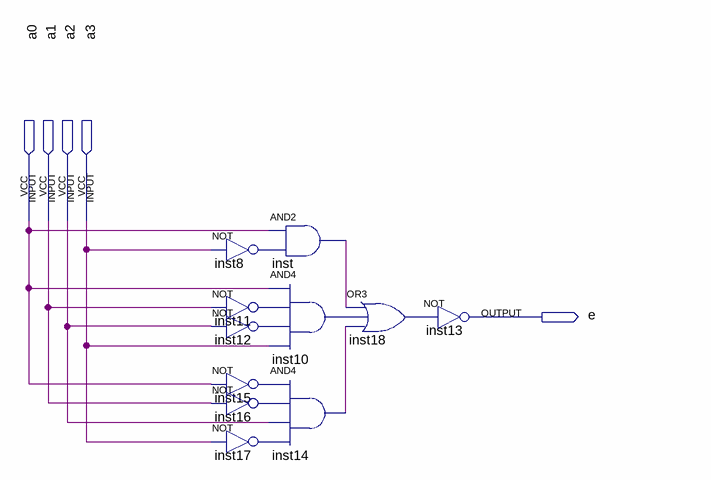
[diagram p0: schematic sheet]
// Quartus schematic E.bdf as structural Verilog: 11 symbols, 5 pins
module E (
  input  a0,
  input  a1,
  input  a2,
  input  a3,
  output e
);

  wire inst8_out, inst10_out, inst11_out, inst12_out, inst14_out, inst15_out, inst16_out, inst17_out,
       inst18_out, inst_out;

  and inst (inst_out, a0, inst8_out);
  not inst8 (inst8_out, a3);
  and inst10 (inst10_out, a0, inst11_out, inst12_out, a3);
  not inst11 (inst11_out, a1);
  not inst12 (inst12_out, a2);
  and inst14 (inst14_out, inst15_out, inst16_out, a2, inst17_out);
  not inst15 (inst15_out, a0);
  not inst16 (inst16_out, a1);
  not inst17 (inst17_out, a3);
  or inst18 (inst18_out, inst_out, inst10_out, inst14_out);
  not inst13 (e, inst18_out);
endmodule
